# EAGLE design Nano XBee (EAGLE 7.0.0)
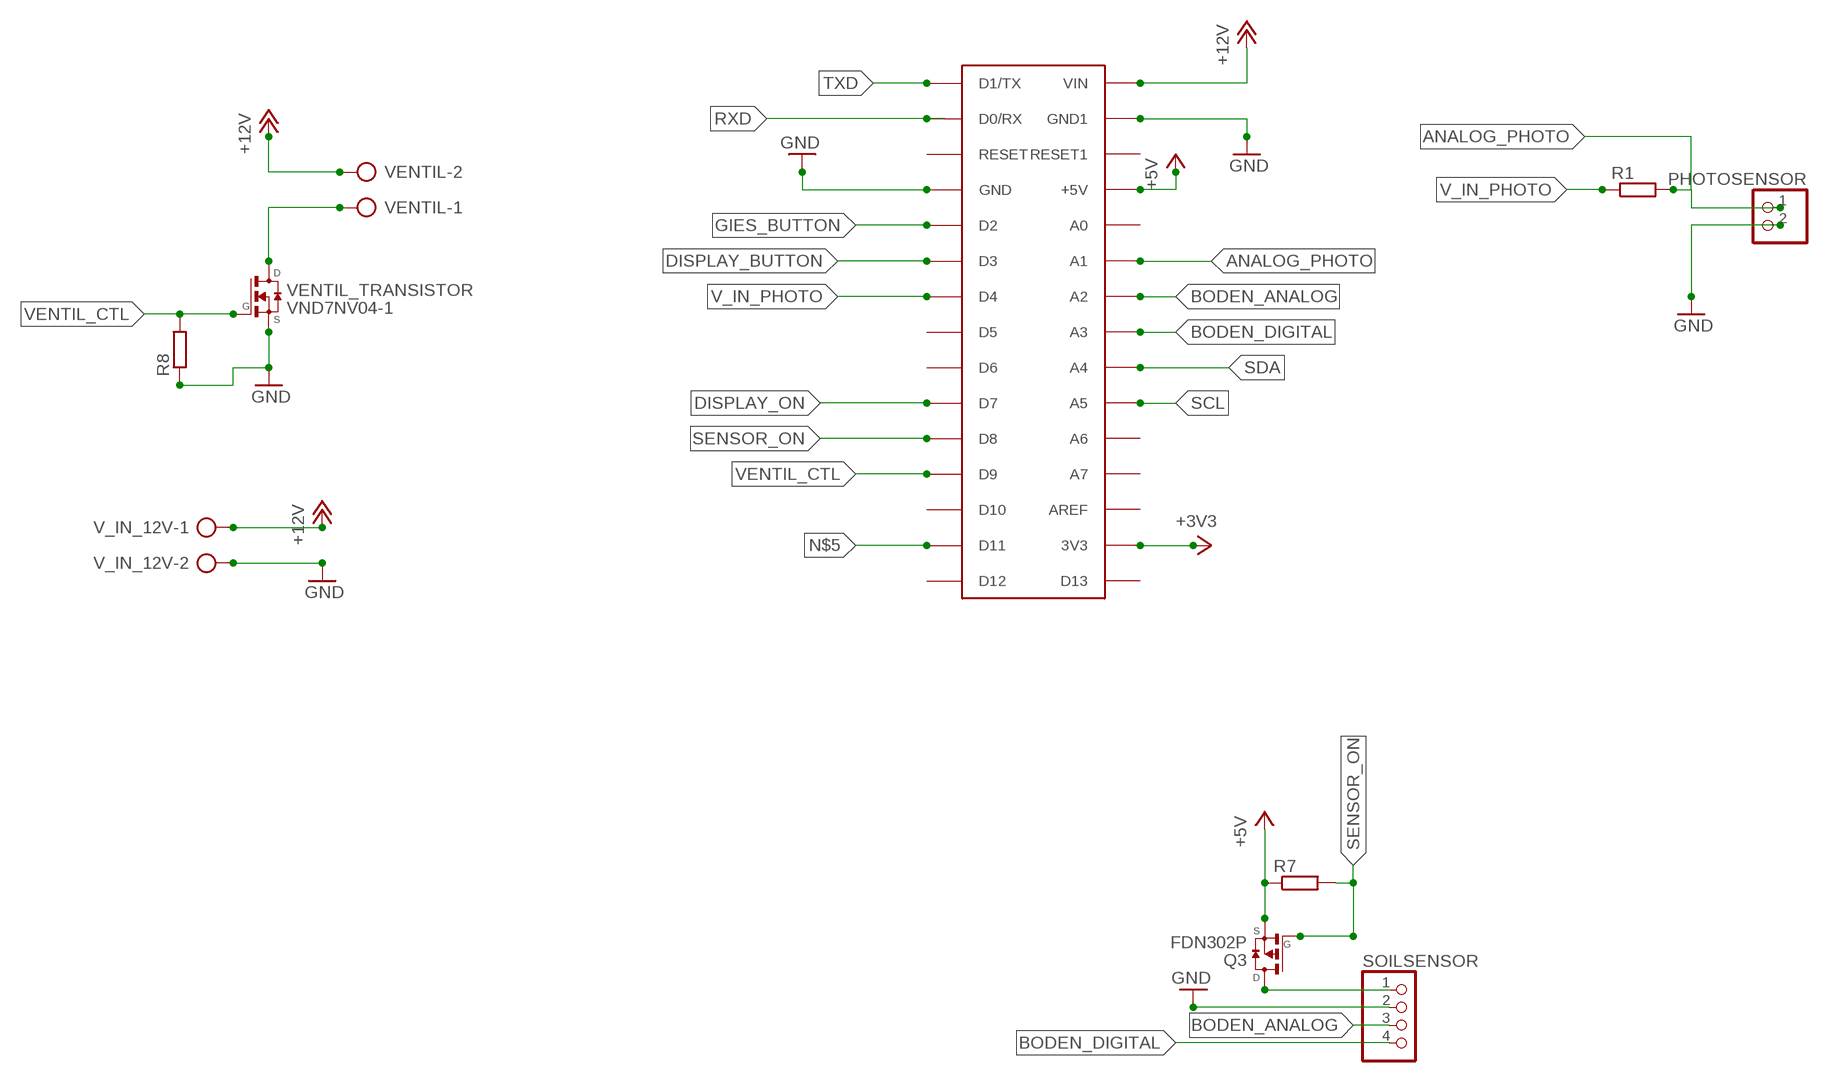
[diagram p0: schematic, sheet 1]

## Parts
PHOTOSENSOR  PINHD-1X2  [1X02]
Q3  FDN302P  [SSOT-3]
R1  R-EU_0207/7  [0207/7]
R7  R-EU_M0805  [M0805]
R8  R-EU_M0805  [M0805]
SOILSENSOR  PINHD-1X4  [1X04]
U$1  ARDUINONANO  [PDIP-32]
V_IN_12V  AK500/2  [AK500/2]
VENTIL  AK500/2  [AK500/2]
VENTIL_TRANSISTOR  VND7NV04-1  [IPAK]

## Nets
+3V3: U$1.3V3
+5V: Q3.2(S) R7.1 U$1.+5V
+12V: U$1.VIN V_IN_12V.1 VENTIL.2
ANALOG_PHOTO: PHOTOSENSOR.1 R1.2 U$1.A1
BODEN_ANALOG: SOILSENSOR.3 U$1.A2
BODEN_DIGITAL: SOILSENSOR.4 U$1.A3
DISPLAY_BUTTON: U$1.D3
DISPLAY_ON: U$1.D7
GIES_BUTTON: U$1.D2
GND: PHOTOSENSOR.2 R8.1 SOILSENSOR.2 U$1.GND U$1.GND1 V_IN_12V.2 VENTIL_TRANSISTOR.3(S)
N$2: VENTIL.1 VENTIL_TRANSISTOR.2(D)
N$3: Q3.3(D) SOILSENSOR.1
N$5: U$1.D11
RXD: U$1.D0/RX
SCL: U$1.A5
SDA: U$1.A4
SENSOR_ON: Q3.1(G) R7.2 U$1.D8
TXD: U$1.D1/TX
V_IN_PHOTO: R1.1 U$1.D4
VENTIL_CTL: R8.2 U$1.D9 VENTIL_TRANSISTOR.1(G)
Unconnected: U$1.A0 U$1.A6 U$1.A7 U$1.AREF U$1.D5 U$1.D6 U$1.D10 U$1.D12 U$1.D13 U$1.RESET U$1.RESET1

## Library data of the parts
PHOTOSENSOR = pinhead:PINHD-1X2: PIN HEADER
Q3 = transistor-fet:FDN302P: P-Channel MOSFET 2.5V Specified PowerTrench
R1 R7 R8 = rcl:R-EU_: RESISTOR, European symbol
SOILSENSOR = pinhead:PINHD-1X4: PIN HEADER
U$1 = jet-lib:ARDUINONANO
V_IN_12V VENTIL = con-ptr500:AK500/2: CONNECTOR; OC_FARNELL: unknown; OC_NEWARK: unknown
VENTIL_TRANSISTOR = transistor-fet:VND7NV04-1: POWER MOSFET N-CH OMNIFET-II 40V 6A IPAK

## Board
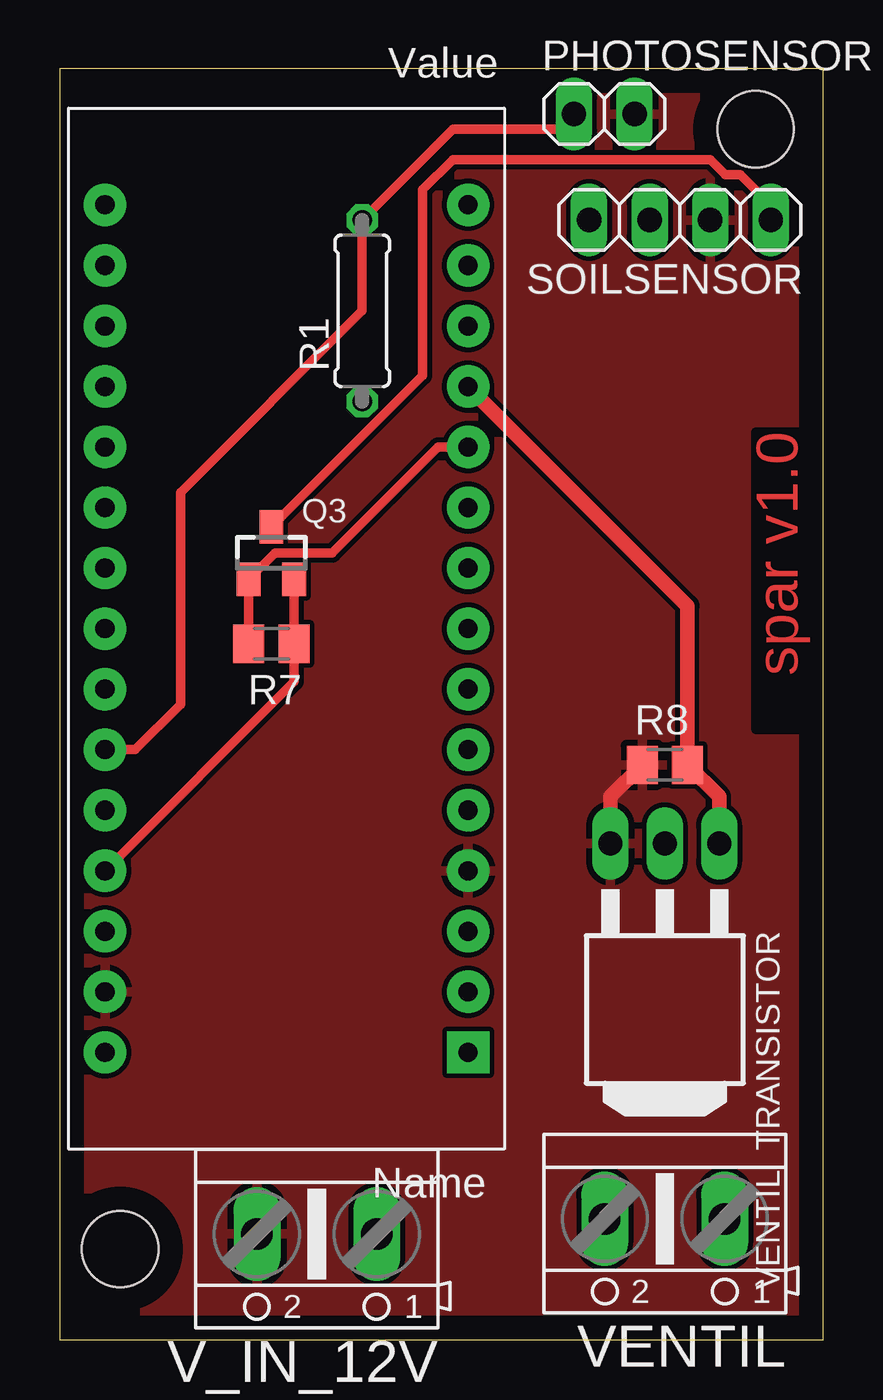
[diagram p1: board, top side]
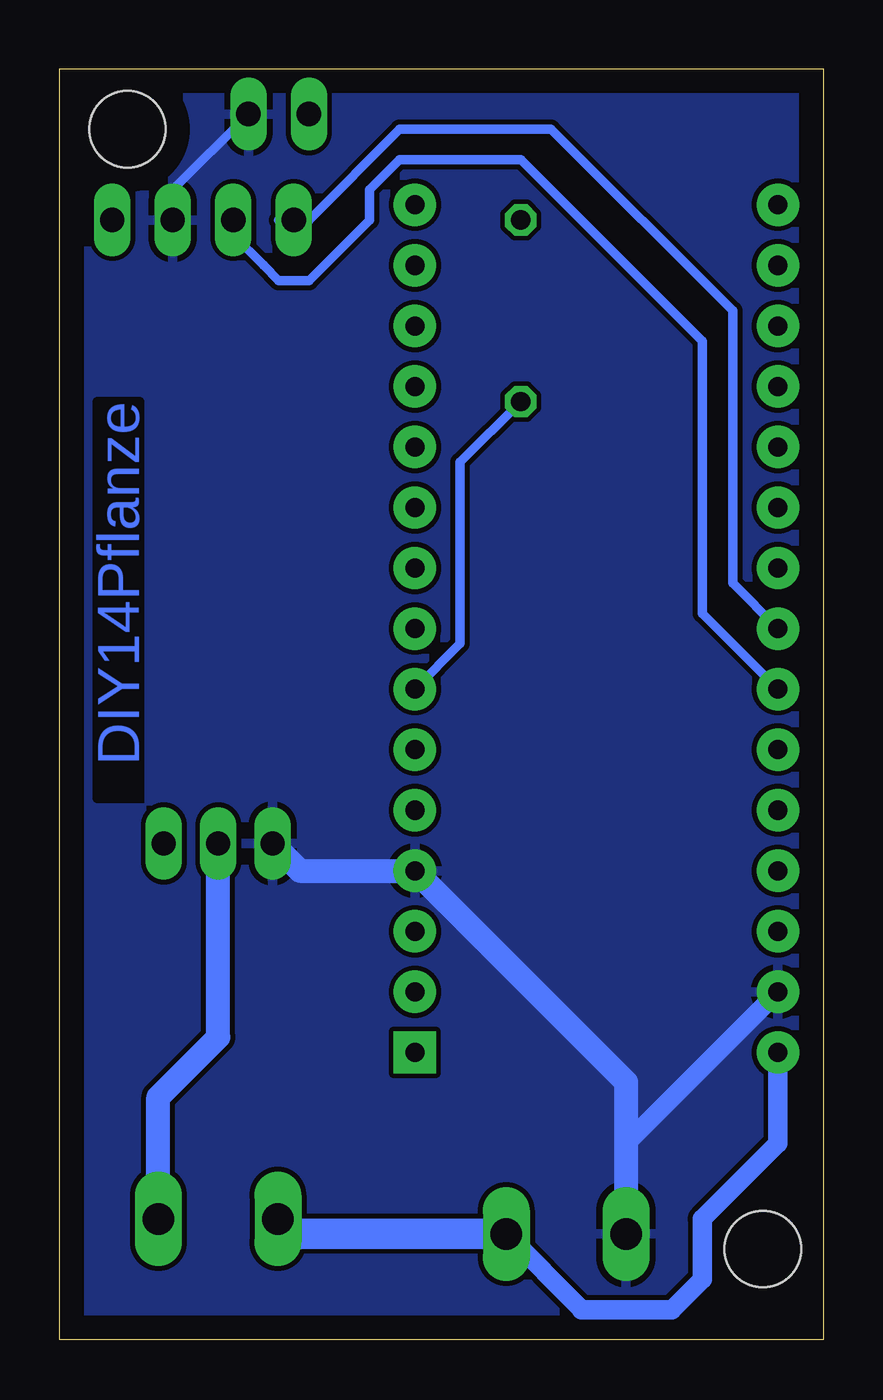
[diagram p2: board, bottom side, seen from below]

Size 32.05 x 53.33 mm. Coordinates in mm from the lower left corner, seen from the top.
Outline: 0,0 32.05,0 32.05,53.33 0,53.33 0,0
Copper layers (1*16): Top 0.035mm / dielectric 1.5mm / Bottom 0.035mm
Design rules "default": minimum track width 10mil, minimum drill 24mil, track to track 8mil, track to pad 8mil, pad to pad 8mil, via to via 8mil, smd to smd 8mil, copper to edge 40mil, drill to drill 8mil, minimum pad ring 10mil, minimum via ring 8mil, stop-mask expansion 4mil, vias tented up to drill 0mil, thermal gap 10mil
Holes 3.2 mm at 29.21,50.8 2.54,3.81

### Footprints (pad centres in the part's own frame; a part is rotated, then mirrored left to right if it is on the bottom)
1X02 = drill 1.016 long: 1 -1.27,0; 2 1.27,0
SSOT-3 = smd 1 x 1.4: 1 -0.95,-1.1; 2 0.95,-1.1; 3 0,1.1
0207/7 = drill 0.813 octagon: 1 -3.81,0; 2 3.81,0
M0805 = smd 1.3 x 1.6: 1 -0.95,0; 2 0.95,0
1X04 = drill 1.016 long: 1 -3.81,0; 2 -1.27,0; 3 1.27,0; 4 3.81,0
PDIP-32 = drill 0.8 pad 1.778: 3V3 15.24,-35.56; +5V 15.24,-10.16; A0 15.24,-12.7; A1 15.24,-15.24; A2 15.24,-17.78; A3 15.24,-20.32; A4 15.24,-22.86; A5 15.24,-25.4; A6 15.24,-27.94; A7 15.24,-30.48; AREF 15.24,-33.02; D0/RX 0,-5.08; D2 0,-12.7; D3 0,-15.24; D4 0,-17.78; D5 0,-20.32; D6 0,-22.86; D7 0,-25.4; D8 0,-27.94; D9 0,-30.48; D10 0,-33.02; D11 0,-35.56; D12 0,-38.1; D13 15.24,-38.1; GND 0,-10.16; GND1 15.24,-5.08; RESET 0,-7.62; RESET1 15.24,-7.62; VIN 15.24,-2.54 | drill 0.8 pad 1.778 square: D1/TX 0,-2.54
AK500/2 = drill 1.321 long: 1 -2.515,0; 2 2.515,0
IPAK = drill 1.016 long: 1 -2.286,-3.683; 2 0,-3.683; 3 2.286,-3.683

### Placement (x,y rotation side)
PHOTOSENSOR  22.86,51.44 0 top
Q3  8.89,33.02 0 top
R1  12.7,43.18 90 top
R7  8.89,29.21 180 top
R8  25.4,24.13 0 top
SOILSENSOR  26.04,46.99 180 top
U$1  17.14,9.53 180 top
V_IN_12V  10.79,4.45 180 top
VENTIL  25.4,5.08 180 top
VENTIL_TRANSISTOR  25.4,17.14 180 top

### Tracks (layer width: path | path; a pad name or v marks a point on that pad's centre or on a via)
+5V
  Top 0.406: U$1.+5V 9.84,27.62 R7.1 Q3.2
+12V
  Bottom 0.813: U$1.VIN 1.91,8.26 5.08,5.08 5.08,2.54 6.35,1.27 10.16,1.27 10.16,1.29 V_IN_12V.1
  Bottom 1.27: V_IN_12V.1 22.25,4.45 VENTIL.2
ANALOG_PHOTO
  Top 0.406: U$1.A1 3.17,24.77 5.08,26.67 5.08,35.56 12.7,43.18 R1.2 16.51,50.8 20.95,50.8 PHOTOSENSOR.1
BODEN_ANALOG
  Bottom 0.406: SOILSENSOR.3 24.77,46.35 23.5,45.09 22.86,44.45 21.59,44.45 19.05,46.99 19.05,48.26 17.78,49.53 12.7,49.53 5.08,41.91 5.08,30.48 U$1.A2
BODEN_DIGITAL
  Bottom 0.406: 22.86,46.99 SOILSENSOR.4 21.59,46.99 17.78,50.8 11.43,50.8 3.81,43.18 3.81,31.75 U$1.A3
GND
  Top 0.61: R8.1 23.11,22.79 VENTIL_TRANSISTOR.3
  Bottom 0.406: SOILSENSOR.2 27.3,48.26 PHOTOSENSOR.2
  Bottom 0.813: V_IN_12V.2 8.28,8.23 U$1.GND1
  Bottom 1.016: VENTIL_TRANSISTOR.3 21.97,19.68 U$1.GND 8.28,10.82 V_IN_12V.2
  pour Bottom: 0,53.34 32.38,53.34 32.38,0 0,0
  pour Top: 0,53.34 32.38,53.34 32.38,0 0,0
N$2
  Bottom 1.016: VENTIL.1 27.91,10.19 25.4,12.7 VENTIL_TRANSISTOR.2
N$3
  Top 0.406: Q3.3 15.24,40.47 15.24,48.26 16.51,49.53 27.3,49.53 27.94,48.9 28.57,48.9 29.84,47.62 SOILSENSOR.1
SENSOR_ON
  Top 0.406: R7.2 Q3.1 9.04,33.02 11.43,33.02 15.88,37.47 U$1.D8
V_IN_PHOTO
  Bottom 0.406: R1.1 15.24,36.83 15.24,29.21 U$1.D4
VENTIL_CTL
  Top 0.61: VENTIL_TRANSISTOR.1 27.69,22.79 R8.2 26.35,30.8 U$1.D9

### Text on the board
Top: spar v1.0
Bottom: DIY14Pflanze